# Altium schematic sheet LDO_3v3_LM2937.SchDoc: 3v3 LDO Module
size A4; Author: Nikola Rašević; Organization: Memristor Robotics
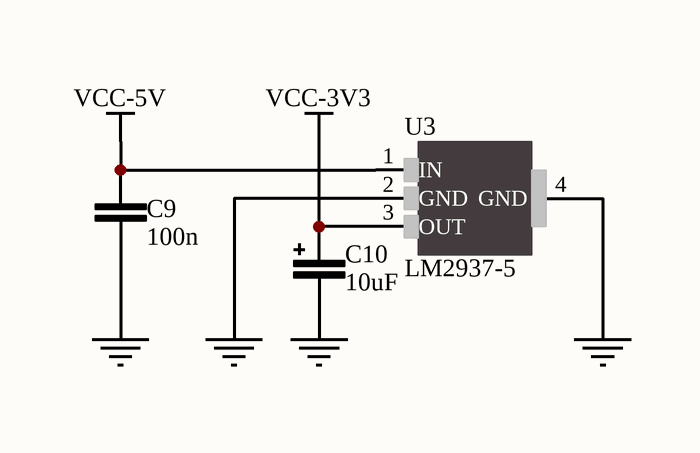
[diagram p0: LDO_3v3_LM2937.SchDoc]

## Parts
C9  100n  [CER_0603]
C10  10uF  [TANT_1210]
U3  LM2937-5  [SOT223]

## Nets
GND: C9.1 C10.2 U3.2(GND) U3.4(GND)
VCC-3V3: C10.1 U3.3(OUT)
VCC-5V: C9.2 U3.1(IN)

## Notes on the sheet
- Title
- Date:
- Design Engineer:
- Time:
- Revision:
- Sheet
- of
- Size:
- A4
- www.memristor-robotics.io
- File:

## Library data of the parts
C9 = 06032105: CAP CER 100n 10V X5R 10% 0603; Capacitance: 100n
C10 = 00001106: CAP TANT 10u; Value: 10uF
U3 = 00000007: IC REG LINEAR 5V 400MA SOT223-4; Manufacturer Part Number: LM2937-5; Datasheet Link: http://www.ti.com/lit/ds/symlink/lm2937.pdf